# Altium schematic sheet NRF.SchDoc: Title
size A4; Date: *******; ApprovedBy: *******; CheckedBy: None; Author: *******; CompanyName: *******; DrawnBy: Name; Engineer: *******; Organization: *******; Address1: *******; Address2: *******; Address3: *******; Address4: *******; DocumentNumber: Doc Num; Revision: *******; SheetNumber: 8; SheetTotal: 8; Subtitle: Subtitle; Project: Project; VersionRevision: VersionRevision; TotalSheet: TotalSheet; CurrentTime: *******; CurrentDate: *******; Time: *******; DocumentFullPathAndName: *******; DocumentName: *******; ModifiedDate: *******; ImagePath: *******; ProjectName: *******; Application_BuildNumber: *******
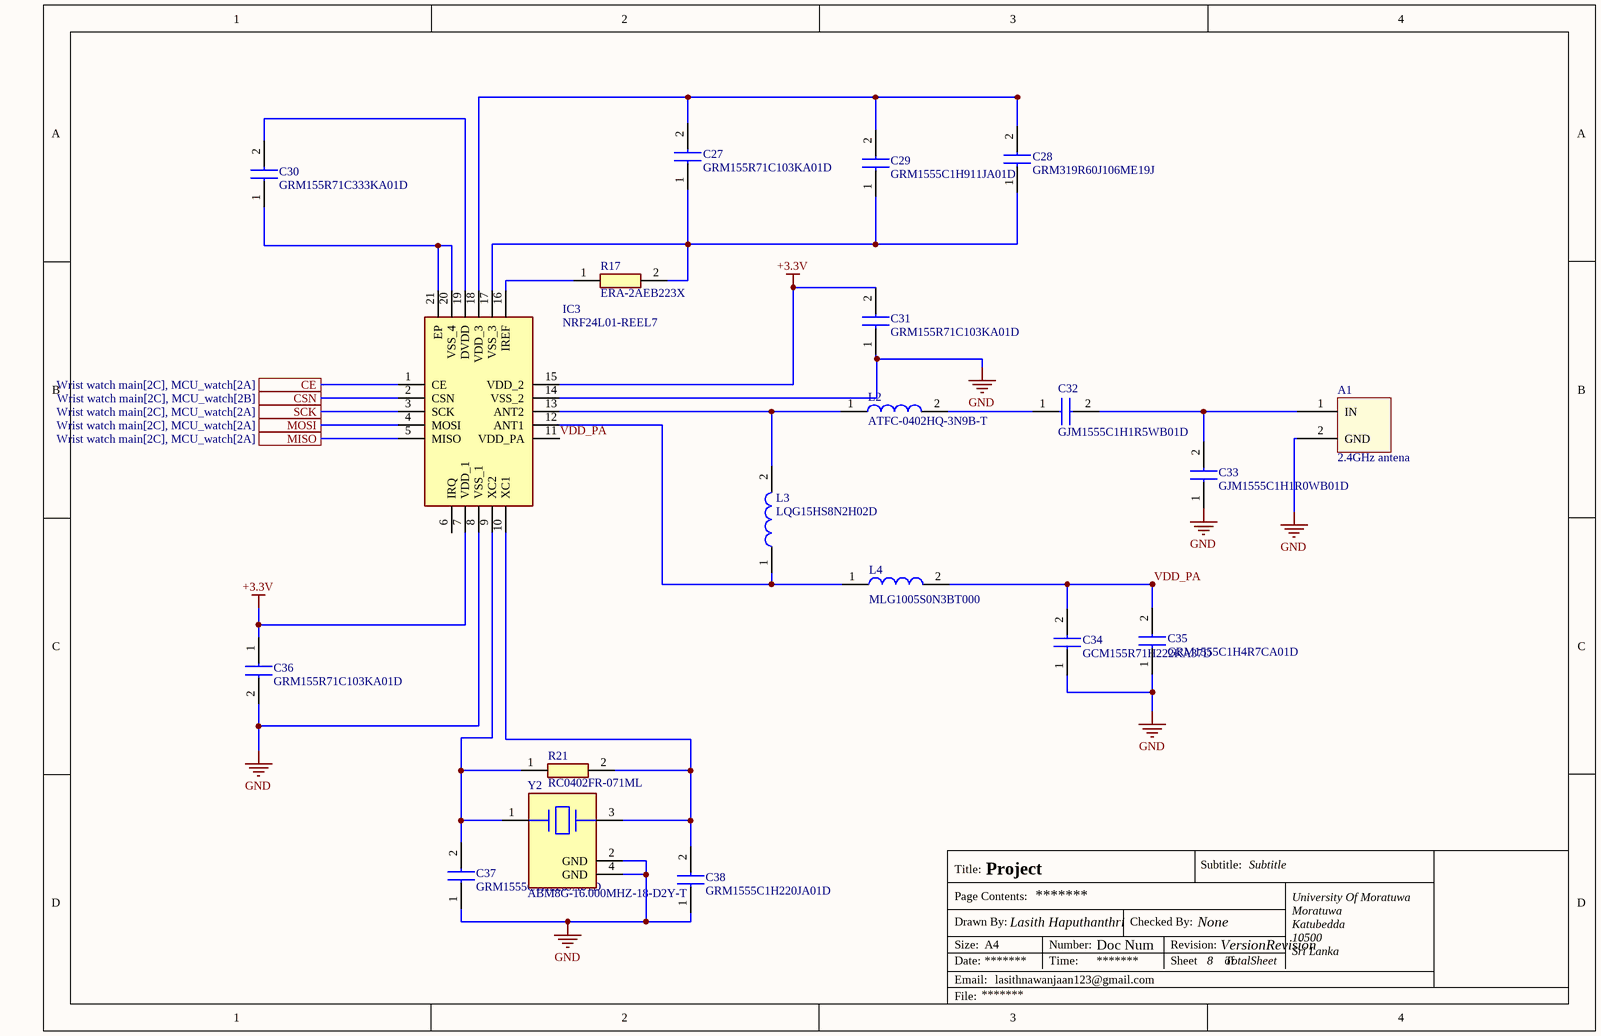
[diagram p0: NRF.SchDoc]

## Parts
A1  2.4GHz antena  [Antena]  (net tie, no BOM)
C27  GRM155R71C103KA01D  [CAPC1005X55N]
C28  GRM319R60J106ME19J  [CAPC3216X95N]
C29  GRM1555C1H911JA01D  [CAPC1005X55N]
C30  GRM155R71C333KA01D  [CAPC1005X55N]
C31  GRM155R71C103KA01D  [CAPC1005X55N]
C32  GJM1555C1H1R5WB01D  [CAPC1005X55N]
C33  GJM1555C1H1R0WB01D  [CAPC1005X55N]
C34  GCM155R71H222KA37D  [CAPC1005X55N]
C35  GRM1555C1H4R7CA01D  [CAPC1005X55N]
C36  GRM155R71C103KA01D  [CAPC1005X55N]
C37  GRM1555C1H220JA01D  [CAPC1005X55N]
C38  GRM1555C1H220JA01D  [CAPC1005X55N]
IC3  NRF24L01-REEL7  [QFN50P400X400X80-21N-D]
L2  ATFC-0402HQ-3N9B-T  [INDC1005X37N]
L3  LQG15HS8N2H02D  [LQG15WH0N7B02D]
L4  MLG1005S0N3BT000  [MLG1005]
R17  ERA-2AEB223X  [ERA2AED122X]
R21  RC0402FR-071ML  [RESC1005X40N]
Y2  ABM8G-16.000MHZ-18-D2Y-T  [FP-ABM8G-MFG]

## Ports
CE (see Wrist watch main[2C], MCU_watch[2A]), CSN (see Wrist watch main[2C], MCU_watch[2B]), MISO (see Wrist watch main[2C], MCU_watch[2A]), MOSI (see Wrist watch main[2C], MCU_watch[2A]), SCK (see Wrist watch main[2C], MCU_watch[2A])

## Nets
+3.3V: C31.2 C36.1 IC3.7(VDD_1) IC3.15(VDD_2)
GND: A1.2(GND) C31.1 C33.1 C34.1 C35.1 C36.2 C37.1 C38.1 IC3.8(VSS_1) IC3.14(VSS_2) Y2.2(GND) Y2.4(GND)
CE: IC3.1(CE) ; port CE
CSN: IC3.2(CSN) ; port CSN
MISO: IC3.5(MISO) ; port MISO
MOSI: IC3.4(MOSI) ; port MOSI
SCK: IC3.3(SCK) ; port SCK
VDD_PA: C34.2 C35.2 IC3.11(VDD_PA) L4.2
NetA1_1: A1.1(IN) C32.2 C33.2
NetC27_1: C27.1 C28.1 C29.1 IC3.17(VSS_3) R17.2
NetC27_2: C27.2 C28.2 C29.2 IC3.18(VDD_3)
NetC30_1: C30.1 IC3.20(VSS_4) IC3.21(EP)
NetC30_2: C30.2 IC3.19(DVDD)
NetC32_1: C32.1 L2.2
NetC37_2: C37.2 IC3.9(XC2) R21.1 Y2.1
NetC38_2: C38.2 IC3.10(XC1) R21.2 Y2.3
NetIC3_12: IC3.12(ANT1) L3.1 L4.1
NetIC3_13: IC3.13(ANT2) L2.1 L3.2
NetIC3_16: IC3.16(IREF) R17.1

Not connected (* = marked no-connect by the designer): IC3 6(IRQ)

## Notes on the sheet
- Title:
- Drawn By:
- Page Contents:
- Checked By:
- Subtitle:
- University Of Moratuwa
- Moratuwa
- Size:
- Date:
- File:
- Email:
- A4
- lasithnawanjaan123@gmail.com
- Lasith Haputhanthri
- Number:
- Time:
- Revision:
- Sheet
- of
- Katubedda
- 10500
- Sri Lanka

## Library data of the parts
C27 C31 C36 = GRM155R71C103KA01D: Capacitor; Manufacturer_Name: Murata Electronics; Datasheet Link: http://www.murata.com/~/media/webrenewal/support/library/catalog/products/capacitor/mlcc/c02e.pdf; Height: 0.55mm; Manufacturer_Part_Number: GRM155R71C103KA01D; Mouser Part Number: 81-GRM36X103K16; Mouser Price/Stock: https://www.mouser.co.uk/ProductDetail/Murata-Electronics/GRM155R71C103KA01D?qs=8YPuuxuUzMI%252B9QLnzeLwhQ%3D%3D; Arrow Part Number: GRM155R71C103KA01D; Arrow Price/Stock: https://www.arrow.com/en/products/grm155r71c103ka01d/murata-manufacturing?region=europe
C28 = GRM319R60J106ME19J: Capacitor; Manufacturer_Name: Murata Electronics; Datasheet Link: http://www.murata.com/~/media/webrenewal/support/library/catalog/products/capacitor/mlcc/c02e.pdf; Height: 0.95mm; Manufacturer_Part_Number: GRM319R60J106ME19J; Mouser Part Number: 81-GRM319R60J106ME9J; Mouser Price/Stock: https://www.mouser.co.uk/ProductDetail/Murata-Electronics/GRM319R60J106ME19J?qs=MY6wChARw2y3T227WLEMMA%3D%3D
C29 = GRM1555C1H911JA01D: Capacitor; Manufacturer_Name: Murata Electronics; Datasheet Link: http://www.murata.com/~/media/webrenewal/support/library/catalog/products/capacitor/mlcc/c02e.pdf; Height: 0.55mm; Manufacturer_Part_Number: GRM1555C1H911JA01D; Mouser Part Number: 81-GRM1555C1H911JA1D; Mouser Price/Stock: https://www.mouser.co.uk/ProductDetail/Murata-Electronics/GRM1555C1H911JA01D?qs=p6VZ%252BklCkRTpKNdGAzqH7g%3D%3D
C30 = GRM155R71C333KA01D: Capacitor; Manufacturer_Name: Murata Electronics; Datasheet Link: http://www.murata.com/~/media/webrenewal/support/library/catalog/products/capacitor/mlcc/c02e.pdf; Height: 0.55mm; Manufacturer_Part_Number: GRM155R71C333KA01D; Arrow Part Number: GRM155R71C333KA01D; Arrow Price/Stock: https://www.arrow.com/en/products/grm155r71c333ka01d/murata-manufacturing
C32 = GJM1555C1H1R5WB01D: Capacitor; Manufacturer_Name: Murata Electronics; Datasheet Link: https://psearch.en.murata.com/capacitor/product/GJM1555C1H1R5WB01%23.html; Height: 0.55mm; Manufacturer_Part_Number: GJM1555C1H1R5WB01D; Mouser Part Number: 81-GJM1555C1H1R5WB1D; Mouser Price/Stock: https://www.mouser.co.uk/ProductDetail/Murata-Electronics/GJM1555C1H1R5WB01D?qs=YLLXL5qGyDucsRPozQcunA%3D%3D; Arrow Part Number: GJM1555C1H1R5WB01D; Arrow Price/Stock: https://www.arrow.com/en/products/gjm1555c1h1r5wb01d/murata-manufacturing?region=nac
C33 = GJM1555C1H1R0WB01D: Capacitor; Manufacturer_Name: Murata Electronics; Datasheet Link: https://psearch.en.murata.com/capacitor/product/GJM1555C1H1R0WB01%23.html; Height: 0.55mm; Manufacturer_Part_Number: GJM1555C1H1R0WB01D; Mouser Part Number: 81-GJM1555C1H1R0WB1D; Mouser Price/Stock: https://www.mouser.co.uk/ProductDetail/Murata-Electronics/GJM1555C1H1R0WB01D?qs=YLLXL5qGyDtaruZHJwTPNg%3D%3D; Arrow Part Number: GJM1555C1H1R0WB01D; Arrow Price/Stock: https://www.arrow.com/en/products/gjm1555c1h1r0wb01d/murata-manufacturing?region=nac
C34 = GCM155R71H222KA37D: Capacitor; Manufacturer_Name: Murata Electronics; Datasheet Link: https://psearch.en.murata.com/capacitor/product/GCM155R71H222KA37%23.html; Height: 0.55mm; Manufacturer_Part_Number: GCM155R71H222KA37D; Mouser Part Number: 81-GCM155R71H222K37D; Mouser Price/Stock: https://www.mouser.co.uk/ProductDetail/Murata-Electronics/GCM155R71H222KA37D?qs=QDXoN8f0aYKEsLYYwicpIw%3D%3D; Arrow Part Number: GCM155R71H222KA37D; Arrow Price/Stock: https://www.arrow.com/en/products/gcm155r71h222ka37d/murata-manufacturing?region=nac
C35 = GRM1555C1H4R7CA01D: Capacitor; Manufacturer_Name: Murata Electronics; Datasheet Link: http://www.murata.com/~/media/webrenewal/support/library/catalog/products/capacitor/mlcc/c02e.pdf; Height: 0.55mm; Manufacturer_Part_Number: GRM1555C1H4R7CA01D; Mouser Part Number: 81-GRM1555C1H4R7CA1D; Mouser Price/Stock: https://www.mouser.co.uk/ProductDetail/Murata-Electronics/GRM1555C1H4R7CA01D?qs=4k9rjS6ZRl7tSQRzstyMVg%3D%3D; Arrow Part Number: GRM1555C1H4R7CA01D; Arrow Price/Stock: https://www.arrow.com/en/products/grm1555c1h4r7ca01d/murata-manufacturing
C37 C38 = GRM1555C1H220JA01D: Capacitor; Manufacturer_Name: Murata Electronics; Datasheet Link: http://www.murata.com/~/media/webrenewal/support/library/catalog/products/capacitor/mlcc/c02e.pdf; Height: 0.55mm; Manufacturer_Part_Number: GRM1555C1H220JA01D; Mouser Part Number: 81-GRM1555C1H220JA1D; Mouser Price/Stock: https://www.mouser.co.uk/ProductDetail/Murata-Electronics/GRM1555C1H220JA01D?qs=4k9rjS6ZRl6sPwaL%252BE1uDQ%3D%3D; Arrow Part Number: GRM1555C1H220JA01D; Arrow Price/Stock: https://www.arrow.com/en/products/grm1555c1h220ja01d/murata-manufacturing?region=nac
IC3 = NRF24L01-REEL7: Integrated Circuit; Manufacturer_Name: Nordic Semiconductor; Datasheet Link: https://4donline.ihs.com/images/VipMasterIC/IC/NRSA/NRSAS00020/NRSAS00020-1.pdf?hkey=EF798316E3902B6ED9A73243A3159BB0; Height: 0.8mm; Manufacturer_Part_Number: NRF24L01-REEL7; Mouser Part Number: 949-NRF24L01-REEL7; Mouser Price/Stock: https://www.mouser.co.uk/ProductDetail/Nordic-Semiconductor/nRF24L01-REEL7?qs=yd0qOhnSiDfNM3Q865kckA%3D%3D; Arrow Part Number: NRF24L01-REEL7; Arrow Price/Stock: null?region=nac
L2 = ATFC-0402HQ-3N9B-T: Inductor; Manufacturer_Name: ABRACON; Datasheet Link: https://abracon.com/Magnetics/inductors/ATFC-0402HQ.pdf; Height: 0.37mm; Manufacturer_Part_Number: ATFC-0402HQ-3N9B-T
L3 = LQG15HS8N2H02D: Inductor; Manufacturer_Name: Murata Electronics; Datasheet Link: https://psearch.en.murata.com/inductor/product/LQG15HS8N2H02%23.html; Height: 0.55mm; Manufacturer_Part_Number: LQG15HS8N2H02D; Mouser Part Number: 81-LQG15HS8N2H02D; Mouser Price/Stock: https://www.mouser.co.uk/ProductDetail/Murata-Electronics/LQG15HS8N2H02D?qs=60uY6ySkanTiptaknJqb2Q%3D%3D; Arrow Part Number: LQG15HS8N2H02D; Arrow Price/Stock: https://www.arrow.com/en/products/lqg15hs8n2h02d/murata-manufacturing
L4 = MLG1005S0N3BT000: Inductor; Manufacturer_Name: TDK; Datasheet Link: https://product.tdk.com/system/files/dam/doc/product/inductor/inductor/smd/catalog/inductor_commercial_high-frequency_mlg1005s_en.pdf; Manufacturer_Part_Number: MLG1005S0N3BT000; Mouser Part Number: 810-MLG1005S0N3BT000; Mouser Price/Stock: https://www.mouser.co.uk/ProductDetail/TDK/MLG1005S0N3BT000?qs=u4%252BEJ9urDASg1T%252BCePJhFw%3D%3D; Arrow Part Number: MLG1005S0N3BT000; Arrow Price/Stock: https://www.arrow.com/en/products/mlg1005s0n3bt000/tdk
R17 = ERA-2AEB223X: Resistor; Manufacturer_Name: Panasonic; Datasheet Link: http://industrial.panasonic.com/cdbs/www-data/pdf/RDM0000/AOA0000C307.pdf; Height: 0.4mm; Manufacturer_Part_Number: ERA-2AEB223X; Mouser Part Number: 667-ERA-2AEB223X; Mouser Price/Stock: https://www.mouser.co.uk/ProductDetail/Panasonic/ERA-2AEB223X?qs=YFwoyZoVY0gOqA4AmOyJ2g%3D%3D; Arrow Part Number: ERA-2AEB223X; Arrow Price/Stock: https://www.arrow.com/en/products/era2aeb223x/panasonic?region=europe
R21 = RC0402FR-071ML: Resistor; Manufacturer_Name: KEMET; Datasheet Link: http://www.yageo.com/documents/recent/PYu-RC0402_51_RoHS_L_6_r.pdf; Height: 0.4mm; Manufacturer_Part_Number: RC0402FR-071ML; Mouser Part Number: 603-RC0402FR-071ML; Mouser Price/Stock: https://www.mouser.co.uk/ProductDetail/YAGEO/RC0402FR-071ML?qs=V1yeUXFNrknfoI4987wfBQ%3D%3D
Y2 = CMP-2000-05039-3: Crystal 12MHz ±20ppm (Tol) ±30ppm (Stability) 18pF FUND 120Ω 4-Pin SMD T/R; Series Resistance: 120R; Max Operating Temperature: 85°C; Mount: Surface Mount; Width: 2.5mm; Series: ABM8G; Termination: SMD/SMT; Frequency Tolerance: 20ppm; Tolerance: 20ppm; Min Operating Temperature: -40°C; Operating Frequency: 12 MHz; Depth: 2.5mm; Load Capacitance: 18pF; Number of Pins: 4; Length: 3.2mm; Radiation Hardening: No; Frequency Stability: 30ppm; Height: 1mm; Packaging: Tape and Reel; Package Quantity: 1000; ESR (Equivalent Series Resistance): 120R; Lead Free: Lead Free; Frequency: 12MHz; Case/Package: CSMD